# Altium schematic sheet INKEY.SchDoc: =DocumentName
size A4; CompanyName: "AS Manufacturing" LLC; Organization: "AS Manufacturing" LLC; Address1: 5 Sklyarenka St.; Address2: Kyiv 04073; Address3: Ukraine; Address4: https://ajax.systems/en/; DocumentNumber: 6; SheetNumber: 6; SheetTotal: 7; Template_version: 1.0.1
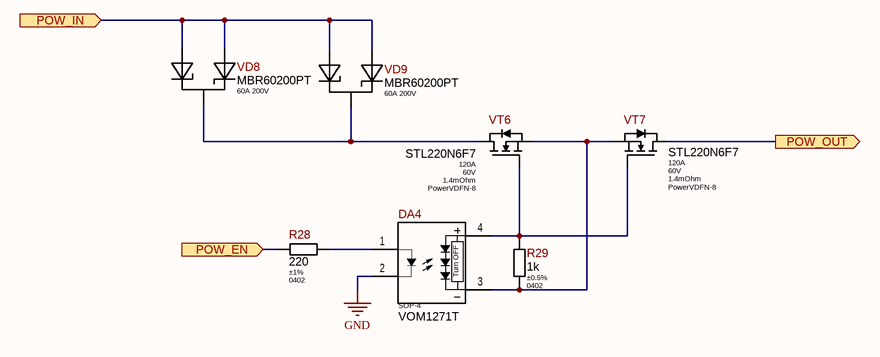
[diagram p0: INKEY.SchDoc]

## Parts
DA4  Package: SOP-4  [SOP-4P254_492X720X222L65X51N]  (hidden comment: VOM1271T)
R28  Tolerance: ±1%  Package: 0402  [R_ANY_CHIP_0402_MED]  (hidden comment: 220)
R29  Tolerance: ±0.5%  Package: 0402  [R_ANY_CHIP_0402_MED]  (hidden comment: 1k)
VD8  MBR60200PT  Power Rating: 60A 200V  [TO220-AB-H]
VD9  MBR60200PT  Power Rating: 60A 200V  [TO220-AB-H]
VT6  Id: 120A  Vds: 60V  Rds: 1.4mOhm  Package: PowerVDFN-8  [VSONP-CLIP-8_5.0x6.00mm]  (hidden comment: STL220N6F7)
VT7  Id: 120A  Vds: 60V  Rds: 1.4mOhm  Package: PowerVDFN-8  [VSONP-CLIP-8_5.0x6.00mm]  (hidden comment: STL220N6F7)

## Ports
POW_EN (in), POW_IN (in), POW_OUT (out)

## Nets
GND: DA4.2(Cathode)
POW_EN: R28.1 ; port POW_EN
POW_IN: VD8.1 VD8.3 VD9.1 VD9.3 ; port POW_IN
POW_OUT: VT7.D(Drain) ; port POW_OUT
NetDA4_1: DA4.1(Anode) R28.2
NetDA4_3: DA4.3(Emitter) R29.2 VT6.S(Source) VT7.S(Source)
NetDA4_4: DA4.4(Collector) R29.1 VT6.G(Gate) VT7.G(Gate)
NetVD8_2: VD8.2 VD9.2 VT6.D(Drain)

## Notes on the sheet
- Title
- Product:
- Project:
- Size:
- Date:
- Variant:
- A4
- Authors:
- Time:
- Sheet
- of
- Rev:
- Commit:
- (in symbol VOM1271T) Turn OFF

## Library data of the parts
DA4 = VOM1271T: Photovoltaic MOSFET Driver with Integrated Fast Turn-Off, 3750 VRMS; Manufacturer: Vishay Semiconductors; Ajax_1C_ID: 15545; Ajax_1C_PN: VOM1271T оптрон; Ajax_1С_Status: Mass Production; Component Status: Released; Wavelength: NONE; GUID_1C: d92e23f6-5530-11e9-ab4e-0050569f2651; Part Number: VOM1271T; Part Type: Optocoupler; Component Type: SMD; Color: NONE; Temperature Range: -40°C ~ 100°C; ComponentLink1URL: https://www.vishay.com/docs/83469/vom1271.pdf; Supplier 1: Digi-Key; Supplier Part Number 1: VOM1271TTR-ND; Replacement: NONE; Price: 1.2896; ComponentLink1Description: Datasheet
R28 = RC0402FR-07220RL: 220 Ohms ±1% 1/16W 0402 Thick Film Resistor; Manufacturer: Yageo; Ajax_1C_ID: 6466; Ajax_1C_PN: 220R 1% 0402 Resistors SMD RoHS; Ajax_1С_Status: Mass Production; Component Status: Released; Power Rating: 0.062W; Voltage: 50V; Temperature Stability: ±100ppm/°C; Replacement: NONE; GUID_1C: c8eea36b-fd66-11e4-ad28-a45d36c4a9e5; Value: 220; Part Number: RC0402FR-07220RL; Part Type: Thick Film; Component Type: SMD; Temperature Range: -55°C ~ 155°C; ComponentLink1URL: https://eu.mouser.com/datasheet/2/447/PYu_RC_Group_51_RoHS_L_10-1664068.pdf; Price: 0.0007; ComponentLink1Description: Datasheet
R29 = RC0402DR-071KL: 1 kOhms ±0.5% 1/16W 0402 Thick Film Resistor; Manufacturer: Yageo; Ajax_1C_ID: 54619; Ajax_1C_PN: 1k 0.5% 0402 RC0402DR-071KL Resistors SMD RoHS; Ajax_1С_Status: Mass Production; Component Status: Released; Power Rating: 0.062W; Voltage: 50V; Temperature Stability: ±100ppm/°C; Replacement: NONE; GUID_1C: a470e21a-6423-11ed-a366-005056994834; Value: 1k; Part Number: RC0402DR-071KL; Part Type: Thick Film; Component Type: SMD; Temperature Range: -55°C ~ 155°C; ComponentLink1URL: https://www.yageo.com/upload/media/product/productsearch/datasheet/rchip/PYu-RC_Group_51_RoHS_L_12.pdf; Supplier 1: Digi-Key; Supplier Part Number 1: 13-RC0402DR-071KLTR-ND; Price: 0.015; ComponentLink1Description: Datasheet
VD8 VD9 = MBR60200PT: DIODE ARR SCHOT 200V 30A TO247-3; Manufacturer: Micro Commercial Co; Manufacturer P/N: MBR60200PT-BP; Name Component: Diode Schottky; Operation Temperature: -55°C ~ 150°C; Library Path 1: Diodes.SchLib; Part Number: MBR60200PT; Value: MBR60200PT; Package/Case: TO-247; Supplier 1: Digi-key; Supplier Part Number 1: 353-MBR60200PT-BP-ND; ComponentLink1Description: Datasheet; ComponentLink1URL: https://www.mccsemi.com/pdf/Products/MBR60200PT(TO-247).pdf
VT6 VT7 = STL220N6F7: 60V, 120A max N-Channel Power MOSFET, 1.2mOhm @ Vgs = 10V; Manufacturer: STMicroelectronics; Ajax_1C_ID: 113144; Ajax_1C_PN: STL220N6F7 60V 120A N-Channel MOSFET POWERFLAT Transistor STMicroelectronics SMD RoHS; Ajax_1С_Status: Mass Production; Component Status: Released; Standard Lead Time: 26 Weeks; Replacement: NONE; GUID_1C: 27ae4649-73fe-11ef-b976-00505699fadc; Part Number: STL220N6F7; Part Type: N-Channel; Component Type: SMD; Temperature Range: -55°C ~ 175°C; ComponentLink1URL: https://eu.mouser.com/datasheet/2/389/stl220n6f7-1851066.pdf; Supplier 1: Digi-Key; Supplier Part Number 1: 497-STL220N6F7TR-ND; Price: 1.47; ComponentLink1Description: Datasheet